# Altium schematic sheet Sheet2.SchDoc
size A4; Organization: Altium Limited; Address1: L3, 12a Rodborough Rd; Address2: Frenchs Forest; Address3: NSW; Address4: Australia 2086
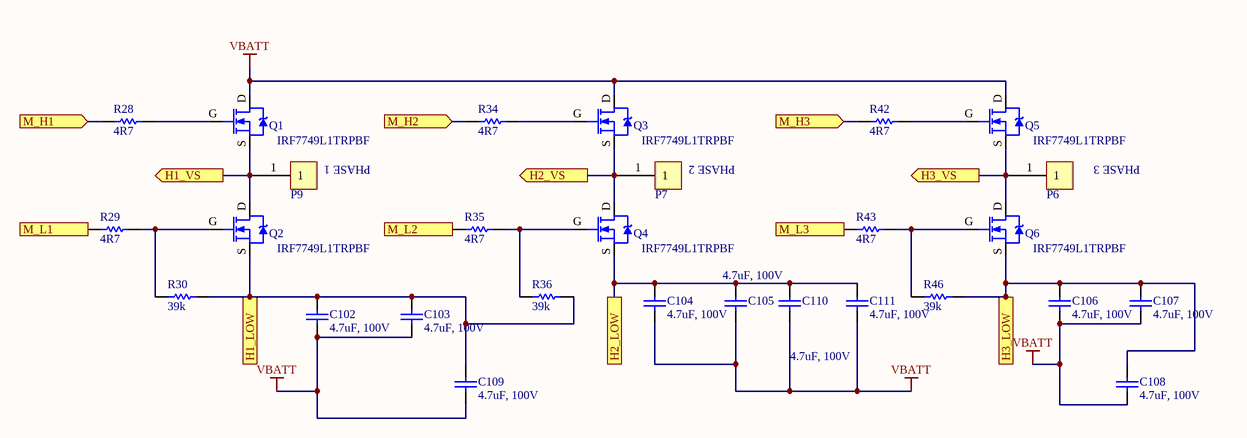
[diagram p0: Sheet2.SchDoc]

## Parts
C102  value 4.7uF, 100V  [SMD-1206 Capacitor]  (hidden comment: CAP)
C103  value 4.7uF, 100V  [SMD-1206 Capacitor]  (hidden comment: CAP)
C104  value 4.7uF, 100V  [SMD-1206 Capacitor]  (hidden comment: CAP)
C105  value 4.7uF, 100V  [SMD-1206 Capacitor]  (hidden comment: CAP)
C106  value 4.7uF, 100V  [SMD-1206 Capacitor]  (hidden comment: CAP)
C107  value 4.7uF, 100V  [SMD-1206 Capacitor]  (hidden comment: CAP)
C108  value 4.7uF, 100V  [SMD-1206 Capacitor]  (hidden comment: CAP)
C109  value 4.7uF, 100V  [SMD-1206 Capacitor]  (hidden comment: CAP)
C110  value 4.7uF, 100V  [SMD-1206 Capacitor]  (hidden comment: CAP)
C111  value 4.7uF, 100V  [SMD-1206 Capacitor]  (hidden comment: CAP)
P6  -  [PAD1]  (value not drawn)
P7  -  [PAD1]  (value not drawn)
P9  -  [PAD1]  (value not drawn)
Q1  Manufacturer Part Number: IRF7749L1TRPBF  [DIRECTFET_1]  (hidden comment: MOSFET_N)
Q2  Manufacturer Part Number: IRF7749L1TRPBF  [DIRECTFET_1]  (hidden comment: MOSFET_N)
Q3  Manufacturer Part Number: IRF7749L1TRPBF  [DIRECTFET_1]  (hidden comment: MOSFET_N)
Q4  Manufacturer Part Number: IRF7749L1TRPBF  [DIRECTFET_1]  (hidden comment: MOSFET_N)
Q5  Manufacturer Part Number: IRF7749L1TRPBF  [DIRECTFET_1]  (hidden comment: MOSFET_N)
Q6  Manufacturer Part Number: IRF7749L1TRPBF  [DIRECTFET_1]  (hidden comment: MOSFET_N)
R28  4R7  [SMD-0603 Resistor]
R29  4R7  [SMD-0603 Resistor]
R30  39k  [SMD-0603 Resistor]
R34  4R7  [SMD-0603 Resistor]
R35  4R7  [SMD-0603 Resistor]
R36  39k  [SMD-0603 Resistor]
R42  4R7  [SMD-0603 Resistor]
R43  4R7  [SMD-0603 Resistor]
R46  39k  [SMD-0603 Resistor]

## Ports
H1_LOW, H1_VS (out), H2_LOW, H2_VS (out), H3_LOW, H3_VS (out), M_H1 (in), M_H2 (in), M_H3 (in), M_L1 (in), M_L2 (in), M_L3 (in)

## Nets
VBATT: C102.1 C103.1 C104.1 C105.1 C106.1 C107.1 C108.1 C109.1 C110.1 C111.1 Q1.D Q3.D Q5.D
H1_LOW: C102.2 C103.2 C109.2 Q2.S R30.2 R36.2 ; port H1_LOW
H1_VS: P9.1 Q1.S Q2.D ; port H1_VS
H2_LOW: C104.2 C105.2 C110.2 C111.2 Q4.S ; port H2_LOW
H2_VS: P7.1 Q3.S Q4.D ; port H2_VS
H3_LOW: C106.2 C107.2 C108.2 Q6.S R46.2 ; port H3_LOW
H3_VS: P6.1 Q5.S Q6.D ; port H3_VS
M_H1: R28.1 ; port M_H1
M_H2: R34.1 ; port M_H2
M_H3: R42.1 ; port M_H3
M_L1: R29.1 ; port M_L1
M_L2: R35.1 ; port M_L2
M_L3: R43.1 ; port M_L3
NetQ1_G: Q1.G R28.2
NetQ2_G: Q2.G R29.2 R30.1
NetQ3_G: Q3.G R34.2
NetQ4_G: Q4.G R35.2 R36.1
NetQ5_G: Q5.G R42.2
NetQ6_G: Q6.G R43.2 R46.1

## Notes on the sheet
- (near P9) PHASE 1
- (near P7) PHASE 2
- (near P6) PHASE 3
- Title
- Size:
- Date:
- A4
- Number:
- Time:
- Revision:
- Sheet
- of
- File:

## Library data of the parts
C102-C111 = 23: 4.7µF 100V Ceramic Capacitor X7S 1206; Manufacturer Part Number: 12061Z475MAT2A; Manufacturer: AVX Corporation; ID: 23; Place (YES/NO): YES
P6 P7 P9 = 1: SMD Power landing; ID: 1; Value: -; Place (YES/NO): -; Manufacturer Part Number: -; Manufacturer: -
Q1-Q6 = 10: MOSFET N-CH 60V 200A DIRECTFETL8; Manufacturer: Infineon Technologies Americas Corp; ID: 10; Place (YES/NO): YES
R28 R29 R34 R35 R42 R43 = 1: R 4.7ohm, 0603; Manufacturer Part Number: RK73H1JTTD4R70F; Manufacturer: KOA Speer; ID: 1; Place (YES/NO): YES; Value: 4R7
R30 R36 R46 = 8: R 39k, 0603; Manufacturer Part Number: ERJ-3EKF3902V; Manufacturer: Panasonic Electronic Components; ID: 8; Place (YES/NO): YES; Value: 39k